# EAGLE schematic encoder_board (EAGLE 9.5.1)
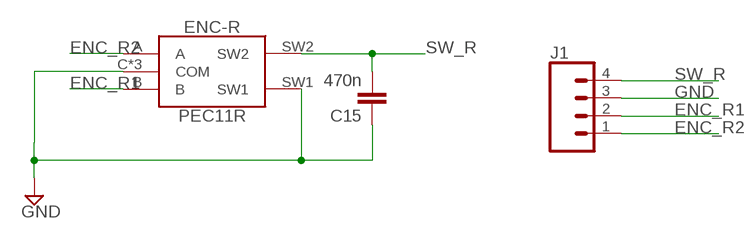
[diagram p0: schematic, sheet 1]

## Parts
C15  470n  C-EUC0603  [C0603]
ENC-R  PEC11R  [PEC11R-4XXXK-SXXXX]
J1  CONN_04LOCK  [1X04_LOCK]

## Nets
ENC_R1: ENC-R.B J1.2
ENC_R2: ENC-R.A J1.1
GND: C15.1 ENC-R.C(COM) ENC-R.SH1(COM) ENC-R.SH2(COM) ENC-R.SW1 J1.3
SW_R: C15.2 ENC-R.SW2 J1.4

## Library data of the parts
C15 = resistor:C-EU: CAPACITOR, European symbol
ENC-R = PEC11R-4215K-S0024:PEC11R: Incremental encoder 24 detents 24 pulses Bourns 24 Pulse Incremental Mechanical Rotary Encoder with a 6 mm Flat Shaft (Not Indexed), Through Hole Source: Datasheet <http://uk.rs-online.com/web/p/products/7377742>; ALLIED_NUMBER: 70407906; ALLIED_PRICE-STOCK: https://www.alliedelec.com/bourns-pec11r-4215k-s0024/70407906/; ARROW_PART_NUMBER: PEC11R-4215K-S0024; ARROW_PRICE-STOCK: http://uk.rs-online.com/web/p/products/1674651; DESCRIPTION: Incremental encoder 24 detents 24 pulses Bourns 24 Pulse Incremental Mechanical Rotary Encoder with a 6 mm Flat Shaft (Not Indexed), Through Hole; HEIGHT: mm; MANUFACTURER_NAME: Bourns; MANUFACTURER_PART_NUMBER: PEC11R-4215K-S0024; RS_PART_NUMBER: 1674651; RS_PRICE-STOCK: http://uk.rs-online.com/web/p/products/1674651
J1 = SparkFun-Connectors:CONN_04: Multi connection point. Often used as Generic Header-pin footprint for 0.1 inch spaced/style header connections On any of the 0.1 inch spaced packages, you can populate with these: Break Away Headers - Straight <https://www.sparkfun.com/products/116> (PRT-00116) Break Away Male Headers - Right Angle <https://www.sparkfun.com/products/553> (PRT-00553) Female Headers <https://www.sparkfun.com/products/115> (PRT-00115) Break Away Headers - Machine Pin <https://www.sparkfun.com/products/117> (PRT-00117) Break Away Female Headers - Swiss Machine Pin <https://www.sparkfun.com/products/743> (PRT-00743) For SCREWTERMINALS and SPRING TERMINALS visit here: Screw Terimnals on SparkFun.com <https://www.sparkfun.com/search/results?term=Screw+Terminals> (5mm/3.5mm/2.54mm spacing) This device is also useful as a general connection point to wire up your design to another part of your project. Our various solder wires solder well into these plated through hole pads. Hook-Up Wire - Assortment (Stranded, 22 AWG) <https://www.sparkfun.com/products/11375> (PRT-11375) Hook-Up Wire - Assortment (Solid Core, 22 AWG) <https://www.sparkfun.com/products/11367> (PRT-11367) View the entire wire category on our website here <https://www.sparkfun.com/categories/141> Special notes: Molex polarized connector foot print use with SKU : PRT-08231 with associated crimp pins and housings. 1MM SMD Version SKU: PRT-10208; PROD_ID: CONN-09696